# EAGLE schematic wagband_schematic_will (EAGLE 7.5.0)
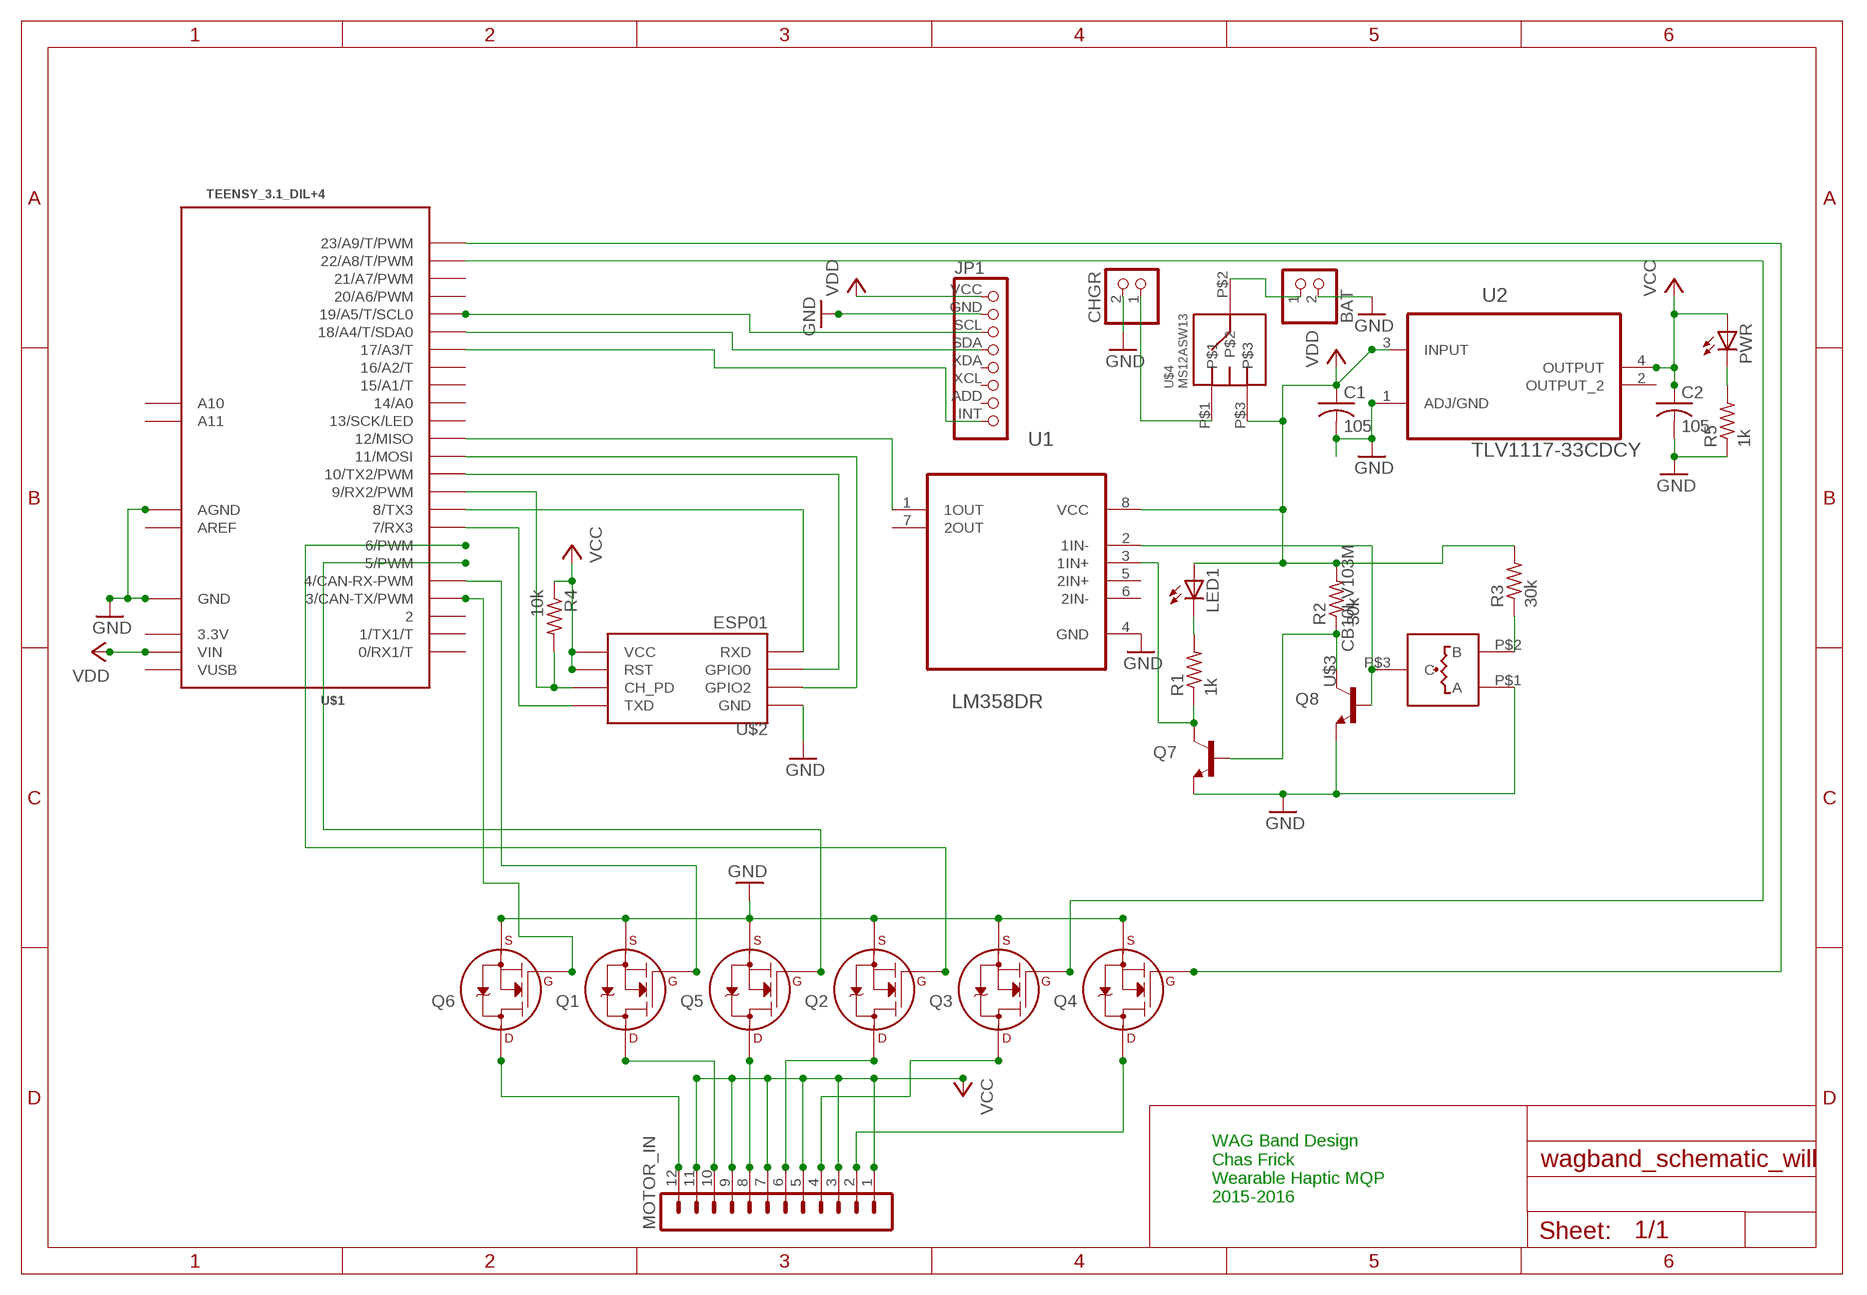
[diagram p0: schematic, sheet 1]

## Parts
BAT  JST_2PIN-THM-RA  [JST-PH-2-THM-RA]
C1  105  C-USC0805K  [C0805K]
C2  105  C-USC0805K  [C0805K]
CHGR  JST_2PIN-THM-RA  [JST-PH-2-THM-RA]
JP1  MPU6050_BREAKOUT  [MPU6050]
LED1  LED5MM  [LED5MM]
MOTOR_IN  MA12-1W  [MA12-1W]
PWR  LED5MM  [LED5MM]
Q1  2N7000_SOT23  [SOT-23]
Q2  2N7000_SOT23  [SOT-23]
Q3  2N7000_SOT23  [SOT-23]
Q4  2N7000_SOT23  [SOT-23]
Q5  2N7000_SOT23  [SOT-23]
Q6  2N7000_SOT23  [SOT-23]
Q7  TRANSISTOR_NPNMMBT3904  [SOT-23]
Q8  TRANSISTOR_NPNMMBT3904  [SOT-23]
R1  1k  R-US_R1206  [R1206]
R2  30k  R-US_R1206  [R1206]
R3  30k  R-US_R1206  [R1206]
R4  10k  R-US_R1206  [R1206]
R5  1k  R-US_R1206  [R1206]
U1  LM358DR  [SOIC127P600X175-8N]
U2  TLV1117-33CDCY  [SOT230P700X180-4N]
U$1  TEENSY_3.1_DIL+4  [TEENSY3-DIL+4]
U$2  ESP01  [ESP01]
U$3  CB10LV103M  [CB10]
U$4  MS12ASW13  [SPDT]

## Nets
GND: BAT.2 C1.2 C2.2 CHGR.2 JP1.GND Q1.2(S) Q2.2(S) Q3.2(S) Q4.2(S) Q5.2(S) Q6.2(S) Q7.2(E) Q8.2(E) R5.1 U1.4(GND) U2.1(ADJ/GND) U$1.AGND U$1.GND U$2.GND U$3.P$1(A)
N$1: Q4.1(G) U$1.23/A9(23/A9/T/PWM)
N$2: Q2.1(G) U$1.6(6/PWM)
N$3: Q3.1(G) U$1.22/A8(22/A8/T/PWM)
N$4: JP1.SDA U$1.18/A4(18/A4/T/SDA0)
N$5: Q6.1(G) U$1.3(3/CAN-TX/PWM)
N$6: Q1.1(G) U$1.4(4/CAN-RX-PWM)
N$7: U$1.7(7/RX3) U$2.TX(TXD)
N$8: JP1.INT U$1.17/A3(17/A3/T)
N$9: MOTOR_IN.12 Q6.3(D)
N$10: MOTOR_IN.10 Q1.3(D)
N$11: MOTOR_IN.8 Q5.3(D)
N$12: U$1.8(8/TX3) U$2.RX(RXD)
N$13: MOTOR_IN.6 Q2.3(D)
N$14: MOTOR_IN.2 Q4.3(D)
N$15: MOTOR_IN.4 Q3.3(D)
N$16: Q5.1(G) U$1.5(5/PWM)
N$17: JP1.SCL U$1.19/A5(19/A5/T/SCL0)
N$18: U$1.11(11/MOSI) U$2.GPIO2
N$19: U$1.10(10/TX2/PWM) U$2.GPIO0
N$20: Q7.3(C) R1.1 U1.3(1IN+)
N$21: PWR.K(C) R5.2
N$22: LED1.K(C) R1.2
N$23: Q7.1(B) Q8.3(C) R2.1
N$24: R4.2 U$1.9(9/RX2/PWM) U$2.CH_PD
N$25: Q8.1(B) U1.2(1IN-) U$3.P$3(C)
N$26: U1.1(1OUT) U$1.12(12/MISO)
N$27: R3.1 U$3.P$2(B)
N$28: BAT.1 U$4.P$2
N$29: CHGR.1 U$4.P$1
VCC: C1.1 C2.1 JP1.VCC LED1.A MOTOR_IN.1 MOTOR_IN.3 MOTOR_IN.5 MOTOR_IN.7 MOTOR_IN.9 MOTOR_IN.11 PWR.A R2.2 R3.2 R4.1 U1.8(VCC) U2.3(INPUT) U2.4(OUTPUT) U$1.VIN U$2.RST U$2.VCC U$4.P$3 ; supply symbol labelled VDD
Unconnected: JP1.ADD JP1.XCL JP1.XDA U1.5(2IN+) U1.6(2IN-) U1.7(2OUT) U2.2(OUTPUT_2) U$1.0(0/RX1/T) U$1.1(1/TX1/T) U$1.2 U$1.13(13/SCK/LED) U$1.14/A0 U$1.15/A1(15/A1/T) U$1.16/A2(16/A2/T) U$1.20/A6(20/A6/PWM) U$1.21/A7(21/A7/PWM) U$1.A10 U$1.A11

## Notes on the sheet
- WAG Band Design
  Chas Frick
  Wearable Haptic MQP
  2015-2016

## Power pins joined to a net without a drawn wire
3.3V: U$1.3.3V
AREF: U$1.AREF
VUSB: U$1.VUSB

## Library data of the parts
BAT CHGR = adafruit:JST_2PIN: JST 2-Pin Connectors of various flavors SMT-RA (S2B-PH-SM4) 4UConnector #17311 SMT (B2B-PH-SM4) THM-RA (S2B-PH) THM (B2B-PH)
C1 C2 = resistor:C-US: CAPACITOR, American symbol
JP1 = mqp_custom_parts:MPU6050_BREAKOUT: PIN HEADER
LED1 PWR = led:LED: LED OSRAM: - CHIPLED LG R971, LG N971, LY N971, LG Q971, LY Q971, LO R971, LY R971 LH N974, LH R974 LS Q976, LO Q976, LY Q976 LO Q996 - Hyper CHIPLED LW Q18S LB Q993, LB Q99A, LB R99A - SideLED LS A670, LO A670, LY A670, LG A670, LP A670 LB A673, LV A673, LT A673, LW A673 LH A674 LY A675 LS A676, LA A676, LO A676, LY A676, LW A676 LS A679, LY A679, LG A679 - Hyper Micro SIDELED® LS Y876, LA Y876, LO Y876, LY Y876 LT Y87S - SmartLED LW L88C, LW L88S LB L89C, LB L89S, LG L890 LS L89K, LO L89K, LY L89K LS L896, LA L896, LO L896, LY L896 - TOPLED LS T670, LO T670, LY T670, LG T670, LP T670 LSG T670, LSP T670, LSY T670, LOP T670, LYG T670 LG T671, LOG T671, LSG T671 LB T673, LV T673, LT T673, LW T673 LH T674 LS T676, LA T676, LO T676, LY T676, LB T676, LH T676, LSB T676, LW T676 LB T67C, LV T67C, LT T67C, LS T67K, LO T67K, LY T67K, LW E67C LS E67B, LA E67B, LO E67B, LY E67B, LB E67C, LV E67C, LT E67C LW T67C LS T679, LY T679, LG T679 LS T770, LO T770, LY T770, LG T770, LP T770 LB T773, LV T773, LT T773, LW T773 LH T774 LS E675, LA E675, LY E675, LS T675 LS T776, LA T776, LO T776, LY T776, LB T776 LHGB T686 LT T68C, LB T68C - Hyper Mini TOPLED® LB M676 - Mini TOPLED Santana® LG M470 LS M47K, LO M47K, LY M47K Source: http://www.osram.convergy.de LUXEON: - LUMILED® LXK2-PW12-R00, LXK2-PW12-S00, LXK2-PW14-U00, LXK2-PW14-V00 LXK2-PM12-R00, LXK2-PM12-S00, LXK2-PM14-U00 LXK2-PE12-Q00, LXK2-PE12-R00, LXK2-PE12-S00, LXK2-PE14-T00, LXK2-PE14-U00 LXK2-PB12-K00, LXK2-PB12-L00, LXK2-PB12-M00, LXK2-PB14-N00, LXK2-PB14-P00, LXK2-PB14-Q00 LXK2-PR12-L00, LXK2-PR12-M00, LXK2-PR14-Q00, LXK2-PR14-R00 LXK2-PD12-Q00, LXK2-PD12-R00, LXK2-PD12-S00 LXK2-PH12-R00, LXK2-PH12-S00 LXK2-PL12-P00, LXK2-PL12-Q00, LXK2-PL12-R00 Source: www.luxeon.com KINGBRIGHT: KA-3528ASYC Source: www.kingbright.com
MOTOR_IN = con-lstb:MA12-1W: PIN HEADER; OC_FARNELL: unknown; OC_NEWARK: unknown
Q1-Q6 = transistors:2N700*: 2N7000, 2N7002, NDS7002A N-channel enhancement mode MOSFET
Q7 Q8 = mqp_custom_parts:TRANSISTOR_NPN: MMBT3904LT1G Made for the MMBT3904LT1G from ON Semiconductor See here: http://www.newark.com/on-semiconductor/mmbt3904lt1g/bipolar-transistor-npn-40v-sot/dp/83H7337 NPN BJT with 200mA capacity and 40V Vce breakdown
R1-R5 = resistor:R-US_: RESISTOR, American symbol
U1 = Texas Instruments_By_element14_Batch_1:LM358DR: OPERATIONAL AMPLIFIERS; MPN: LM358DR; OC_FARNELL: 1831865; OC_NEWARK: 34K7599; PACKAGE: SOIC-8; SUPPLIER: Texas Instruments
U2 = Texas Instruments_By_element14_Batch_1:TLV1117-33CDCY: V REG, LDO, 3.3V, 0.8A; MPN: TLV1117-33CDCY; OC_FARNELL: 1494942; OC_NEWARK: 67K8520; PACKAGE: SOT-223-3; SUPPLIER: TEXAS INSTRUMENTS
U$1 = Teensy_3_and_LC_Series_Boards_v1.1:TEENSY_3.1_DIL+4: Teensy 3.1 and 3.2 in a DIL package with the inner 4 pins
U$2 = esp8266modules:ESP01: ESP8266 Wifi module 01
U$3 = mqp_custom_parts:CB10LV103M
U$4 = mqp_custom_parts:MS12ASW13